# EAGLE design StripConnector (EAGLE 8.2.1)
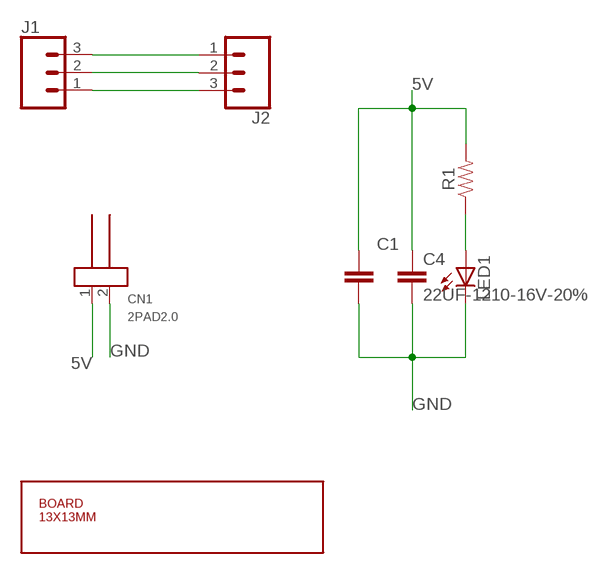
[diagram p0: schematic, sheet 1]

## Parts
C1  CAPACITOR_NPOL-0805  [C805]
C4  22UF-1210-16V-20%  [1210]
CN1  2PAD2.0  [2POLE_P2.0]
J1  CONN_03LONGPADS  [1X03_LONGPADS]
J2  CONN_03LONGPADS  [1X03_LONGPADS]
LED1  LED-0805  [LED-805]
R1  RESISTOR0805  [0805]
U$1  BOARD_13X13MM  [13X13]

## Nets
5V: C1.1 C4.1 CN1.1 J1.1 J2.3 R1.2
DATA: J1.2 J2.2
GND: C1.2 C4.2 CN1.2 J1.3 J2.1 LED1.C
N$2: LED1.A R1.1

## Library data of the parts
C1 = dp_devices:CAPACITOR_NPOL: Non-Polarized capacitor in various packages
C4 = SparkFun-Capacitors:22UF: 22µF ceramic capacitors A capacitor is a passive two-terminal electrical component used to store electrical energy temporarily in an electric field.
CN1 = Pad:2PAD
J1 J2 = SparkFun-Connectors:CONN_03: Multi connection point. Often used as Generic Header-pin footprint for 0.1 inch spaced/style header connections On any of the 0.1 inch spaced packages, you can populate with these: Break Away Headers - Straight <https://www.sparkfun.com/products/116> (PRT-00116) Break Away Male Headers - Right Angle <https://www.sparkfun.com/products/553> (PRT-00553) Female Headers <https://www.sparkfun.com/products/115> (PRT-00115) Break Away Headers - Machine Pin <https://www.sparkfun.com/products/117> (PRT-00117) Break Away Female Headers - Swiss Machine Pin <https://www.sparkfun.com/products/743> (PRT-00743) Stackable Header - 3 Pin (Female, 0.1") <https://www.sparkfun.com/products/13875> (PRT-13875) For SCREWTERMINALS and SPRING TERMINALS visit here: Screw Terimnals on SparkFun.com <https://www.sparkfun.com/search/results?term=Screw+Terminals> (5mm/3.5mm/2.54mm spacing) This device is also useful as a general connection point to wire up your design to another part of your project. Our various solder wires solder well into these plated through hole pads. Hook-Up Wire - Assortment (Stranded, 22 AWG) <https://www.sparkfun.com/products/11375> (PRT-11375) Hook-Up Wire - Assortment (Solid Core, 22 AWG) <https://www.sparkfun.com/products/11367> (PRT-11367) View the entire wire category on our website here <https://www.sparkfun.com/categories/141> Special notes: Molex polarized connector foot print use with SKU : PRT-08232 with associated crimp pins and housings.
LED1 = dp_devices:LED: Light Emitting Diode
R1 = SparkFun-Resistors:RESISTOR: Generic Resistor Package
U$1 = MyBreadBoards:BOARD_13X13MM

## Board
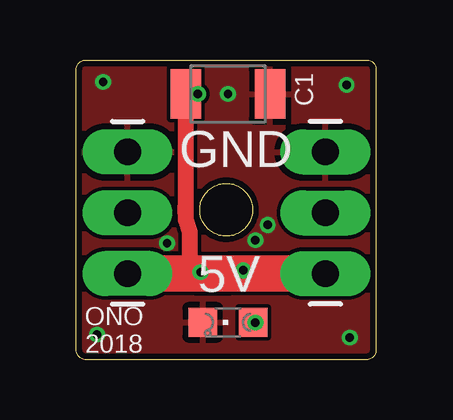
[diagram p1: board, top side]
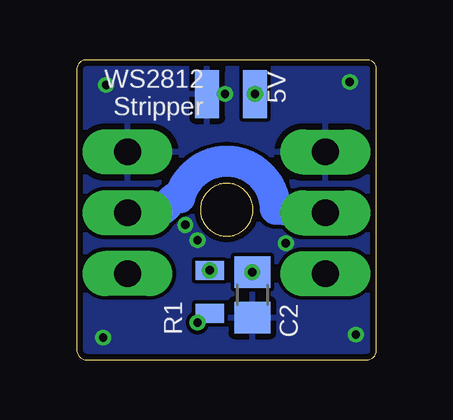
[diagram p2: board, bottom side, seen from below]

Size 12.5 x 12.5 mm. Coordinates in mm from the lower left corner, seen from the top.
Copper layers (1*16): Top 0.035mm / dielectric 1.5mm / Bottom 0.035mm
Design rules "dirt_cheap_dirty_boards.v2": minimum track width 5mil, minimum drill 12mil, track to track 6mil, track to pad 6mil, pad to pad 6mil, via to via 6mil, smd to smd 0mil, copper to edge 10mil, drill to drill 10mil, minimum pad ring 10mil, minimum via ring 6mil, stop-mask expansion 2mil, vias tented up to drill 25mil, thermal gap 10mil

### Footprints (pad centres in the part's own frame; a part is rotated, then mirrored left to right if it is on the bottom)
C805 = smd 1.3 x 1.5: 1 -0.95,0; 2 0.95,0
1210 = smd 1.27 x 2.06: 1 -1.755,0; 2 1.755,0
2POLE_P2.0 = smd 1 x 2: 1 1,0; 2 -1,0
1X03_LONGPADS = drill 1.118 pad 1.88 long: 1 0,0; 2 2.54,0; 3 5.08,0
LED-805 = smd 1.2 x 1.2: A 0,-1.05; C 0,1.05
0805 = smd 0.8 x 1.2: 1 -0.9,0; 2 0.9,0

### Placement (x,y rotation side)
C1  5.18,2.7 270 bottom
C4  6.32,11.08 0 top
CN1  6.07,11.08 0 bottom
J1  2.13,3.58 90 top
J2  10.39,8.66 270 top
LED1  6.32,1.55 90 top
R1  6.96,2.82 90 bottom
U$1  -0.03,-0.1 0 top

### Tracks (layer width: path | path; a pad name or v marks a point on that pad's centre or on a via)
5V  (via drill 0.35)
  Top 0.152: 6.32,3.58 6.82,3.58 R1.2 | C1.1 5.12,3.65 5.05,3.58 | C4.1 CN1.1
  Top 0.66: C4.1 4.57,6.57 4.56,6.54 4.56,6.42 4.54,6.35 4.55,6.33 4.54,6.28 4.55,6.25 4.56,6.25 4.55,6.25 4.54,6.22 4.55,6.17 4.54,6.15 4.56,6.08 4.56,5.84 4.72,5.32 4.72,4.04 5.05,3.71 5.12,3.71 C1.1
  Top 1.524: J2.3 6.32,3.58 5.05,3.58 J1.1
  other vias: 5.18,3.65 6.96,3.72 5.07,11.08
DATA
  Bottom 1.27: J1.2 4.22,6.25 4.21,6.28 4.23,6.31 4.24,6.34 4.23,6.45 4.23,6.46 4.26,6.56 4.26,6.58 4.25,6.62 4.26,6.65 4.26,6.69 4.29,6.72 4.3,6.75 4.31,6.84 4.31,6.85 4.31,6.86 4.32,6.86 4.36,6.95 4.36,6.96 4.36,7 4.38,7.04 4.39,7.08 4.44,7.16 4.46,7.21 4.47,7.22 4.47,7.23 4.48,7.24 4.53,7.3 4.53,7.35 4.57,7.38 4.59,7.43 4.64,7.45 4.67,7.51 4.67,7.53 4.69,7.54 4.69,7.55 4.71,7.56 4.76,7.6 4.77,7.65 4.82,7.68 4.85,7.73 4.89,7.73 4.95,7.81 4.96,7.81 4.97,7.83 4.99,7.83 5.05,7.86 5.07,7.91 5.12,7.93 5.15,7.97 5.2,7.97 5.26,8.02 5.27,8.03 5.28,8.03 5.29,8.04 5.34,8.06 5.42,8.11 5.46,8.12 5.5,8.14 5.54,8.14 5.55,8.14 5.64,8.18 5.64,8.19 5.65,8.19 5.71,8.2 5.81,8.24 5.85,8.24 5.88,8.25 5.92,8.24 5.94,8.24 6.04,8.27 6.05,8.27 6.11,8.27 6.22,8.29 6.25,8.28 6.28,8.29 6.31,8.27 6.34,8.26 6.45,8.27 6.46,8.27 6.56,8.24 6.58,8.24 6.62,8.25 6.65,8.24 6.69,8.24 6.72,8.21 6.75,8.2 6.84,8.19 6.85,8.19 6.86,8.19 6.9,8.16 7,8.14 7.04,8.12 7.08,8.11 7.11,8.07 7.12,8.06 7.19,8.04 7.21,8.04 7.22,8.03 7.23,8.03 7.31,7.97 7.35,7.97 7.38,7.93 7.43,7.91 7.45,7.86 7.51,7.83 7.53,7.83 7.54,7.81 7.56,7.81 7.56,7.79 7.61,7.74 7.65,7.73 7.68,7.68 7.73,7.65 7.73,7.61 7.81,7.55 7.82,7.54 7.83,7.53 7.87,7.44 7.91,7.43 7.93,7.38 7.97,7.35 7.97,7.3 8.02,7.24 8.03,7.23 8.03,7.22 8.04,7.21 8.07,7.11 8.11,7.08 8.12,7.04 8.14,7 8.14,6.96 8.14,6.95 8.18,6.86 8.19,6.86 8.19,6.85 8.19,6.84 8.2,6.75 8.21,6.73 8.44,6.73 8.89,6.28 10.24,6.28 J2.2
GND  (via drill 0.35)
  other vias: 1.12,11.59 6.32,11.08 11.28,11.46 7.47,4.98 7.98,5.62 3.78,4.85 11.4,0.92 0.86,1.04
  pour Top: -1.3,12.6 -1.3,-0.1 -0.03,-1.37 12.67,-1.37 13.94,-0.1 13.94,12.6 12.67,13.87 -0.03,13.87
  pour Bottom: -1.3,12.6 -1.3,-0.1 -0.03,-1.37 12.67,-1.37 13.94,-0.1 13.94,12.6 12.67,13.87 -0.03,13.87
N$2  (via drill 0.35)
  Top 0.152: LED1.A 7.46,1.55 v7.47,1.54
  Bottom 0.152: R1.1 7.09,1.92 v7.47,1.54

### Text on the board
tPlace: C1 | GND | 5V | ONO / 2018
bPlace: WS2812 / Stripper | 5V | R1 | C2